# Altium schematic sheet GSM.SchDoc: GSM
size A4; SheetNumber: 9; SheetTotal: 10
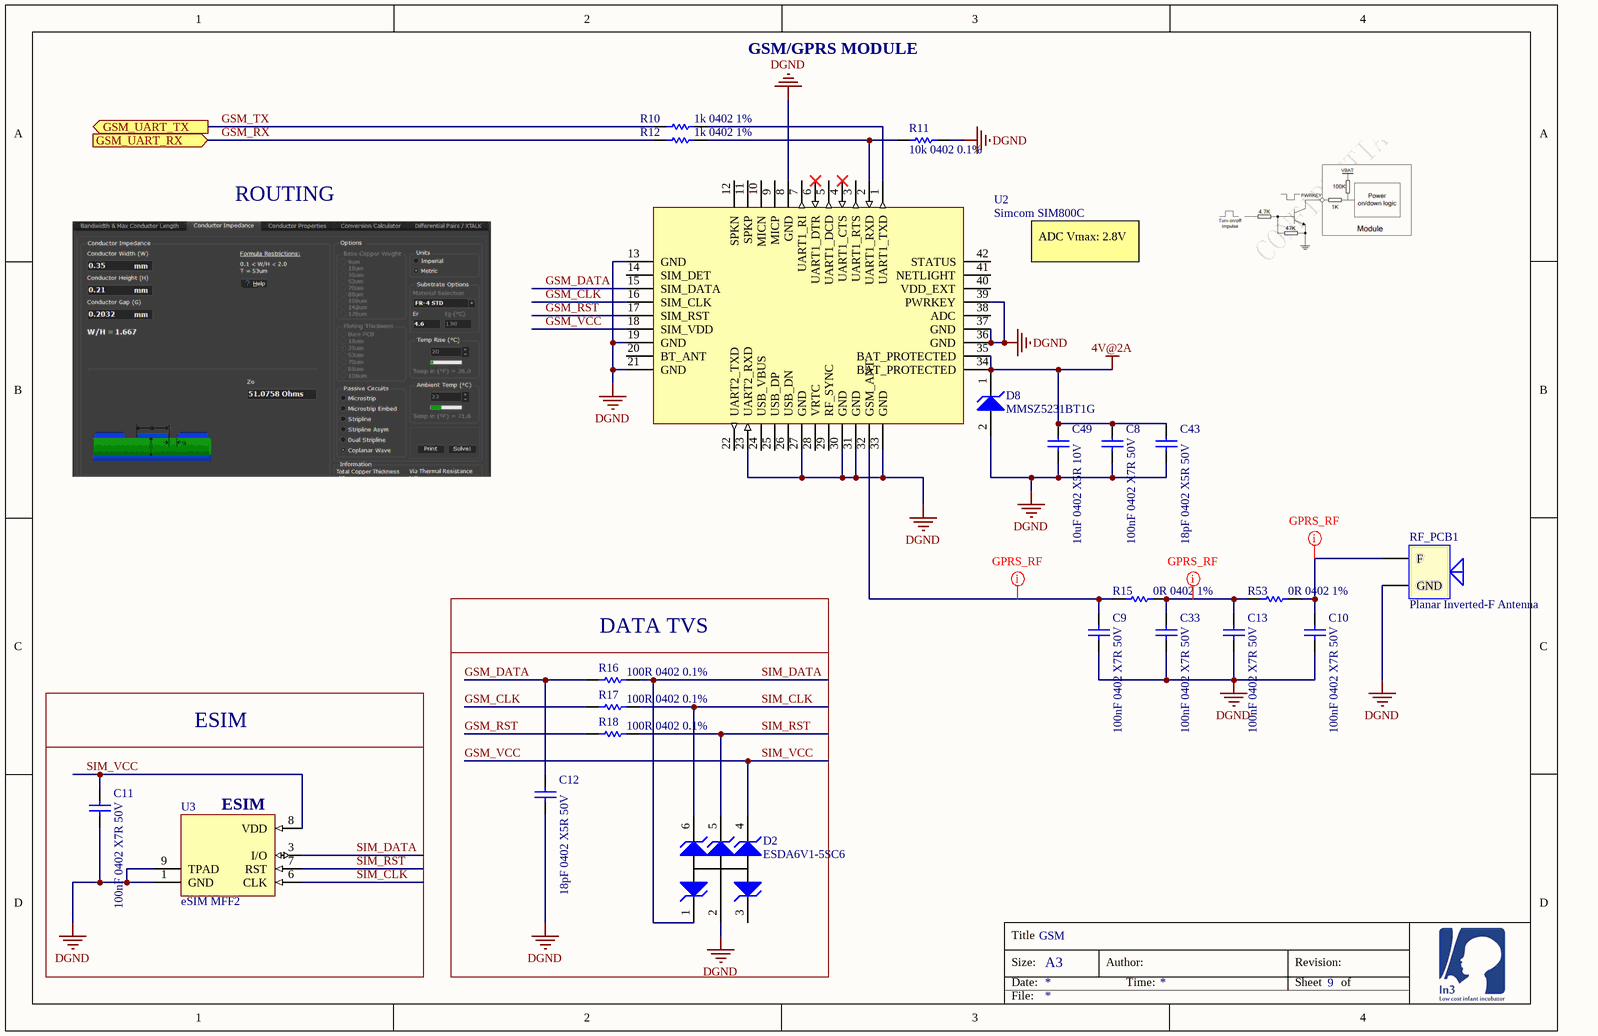
[diagram p0: GSM.SchDoc]

## Parts
C8  100nF 0402 X7R 50V  [CAPC1005X55X25NL5T10]
C9  100nF 0402 X7R 50V  [CAPC1005X55X25NL5T10]
C10  100nF 0402 X7R 50V  [CAPC1005X55X25NL5T10]
C11  100nF 0402 X7R 50V  [CAPC1005X55X25NL5T10]
C12  18pF 0402 X5R 50V  [CAPC1005X55X25NL5T10]
C13  100nF 0402 X7R 50V  [CAPC1005X55X25NL5T10]
C33  100nF 0402 X7R 50V  [CAPC1005X55X25NL5T10]
C43  18pF 0402 X5R 50V  [CAPC1005X55X25NL5T10]
C49  10uF 0402 X5R 10V  [CAPC1005X55X25NL5T10]
D2  ESDA6V1-5SC6  [MF06A_N]
D8  MMSZ5231BT1G  [ONSC-SOD-123-2-425-04_V]
R10  1k 0402 1%  [RESC1005X40X25ML05T10]
R11  10k 0402 0.1%  [RESC1005X40X25ML05T10]
R12  1k 0402 1%  [RESC1005X40X25ML05T10]
R15  0R 0402 1%  [RESC1005X40X25ML05T10]
R16  100R 0402 0.1%  [RESC1005X40X25ML05T10]
R17  100R 0402 0.1%  [RESC1005X40X25ML05T10]
R18  100R 0402 0.1%  [RESC1005X40X25ML05T10]
R53  0R 0402 1%  [RESC1005X40X25ML05T10]
RF_PCB1  Planar Inverted-F Antenna  [PCB-k9titb4465gfk1ijwrnj-1]  (no BOM)
U2  Simcom SIM800C  [SIM800C]
U3  eSIM MFF2  [SON127P600X95_HS-9N]

## Blocks framed on the sheet
DATA TVS: C12 D2 R16-R18
ESIM: C11 U3

## Ports
GSM_UART_RX (in), GSM_UART_TX (out)

## Nets
4V@2A: C8.2 C43.2 C49.2 D8.1(K) U2.34(BAT_PROTECTED) U2.35(BAT_PROTECTED)
DGND: C8.1 C9.1 C10.1 C11.1 C12.1 C13.1 C33.1 C43.1 C49.1 D2.2(K) D8.2(A) R11.1 RF_PCB1.2(GND) U2.8(GND) U2.13(GND) U2.19(GND) U2.21(GND) U2.23(UART2_RXD) U2.27(GND) U2.30(GND) U2.31(GND) U2.33(GND) U2.36(GND) U2.37(GND) U2.39(PWRKEY) U3.1(GND) U3.9(TPAD)
GSM_CLK: R17.2 U2.16(SIM_CLK)
GSM_DATA: C12.2 R16.2 U2.15(SIM_DATA)
GSM_RST: R18.2 U2.17(SIM_RST)
GSM_RX: R12.2 ; port GSM_UART_RX
GSM_TX: R10.2 ; port GSM_UART_TX
GSM_VCC: C11.2 D2.4(A) U2.18(SIM_VDD) U3.8(VDD)  [also labelled SIM_VCC]
SIM_CLK: D2.6(A) R17.1 U3.6(CLK)
SIM_DATA: D2.1(K) R16.1 U3.3(I/O)
SIM_RST: D2.5(A) R18.1 U3.7(RST)
NetC9_2: C9.2 R15.2 U2.32(GSM_ANT)
NetC10_2: C10.2 R53.1 RF_PCB1.1(F)
NetC13_2: C13.2 C33.2 R15.1 R53.2
NetR10_1: R10.1 U2.1(UART1_TXD)
NetR11_2: R11.2 R12.1 U2.2(UART1_RXD)

Not connected (* = marked no-connect by the designer): D2 3(K); U2 3(UART1_RTS) 4(UART1_CTS)* 5(UART1_DCD) 6(UART1_DTR)* 7(UART1_RI) 9(MICP) 10(MICN) 11(SPKP) 12(SPKN) 14(SIM_DET) 20(BT_ANT) 22(UART2_TXD) 24(USB_VBUS) 25(USB_DP) 26(USB_DN) 28(VRTC) 29(RF_SYNC) 38(ADC) 40(VDD_EXT) 41(NETLIGHT) 42(STATUS)

## Layout directives
net class GPRS_RF: NetC9_2, NetC10_2, NetC13_2

## Notes on the sheet
- GSM/GPRS MODULE
- ROUTING
- ADC Vmax: 2.8V
- (near U3) ESIM
- Title
- Size:
- Date:
- A3
- Author:
- Time:
- Revision:
- Sheet
- of
- File:

## Library data of the parts
C8-C13 C33 C43 C49 = CMP-1662-00020-1: ComponentLink2Description: Datasheet; ComponentLink2URL: http://psearch.en.murata.com/capacitor/product/GRM155R60J105KE19%23.pdf; ComponentLink1Description: Manufacturer URL; ComponentLink1URL: http://www.murata.com/
  C8-C11 C13 C33: LCSC_PN: C77020
  C12 C43: LCSC_PN: C33149
  C49: LCSC_PN: C77000
D2 = CMP-924f5b40f9684d88-1: ESDA Series 5 Channel 6.1 V 50 pF SMT Uni Directional Transil Array - SOT-23-6L; Operating Voltage: 6.10 V; Power Rating: 100 W; Breakdown Voltage: 7.20 V; Lead-Free Status: Lead Free; REACH SVHC Compliance: No SVHC; Number of Pins: 6; Case/Package: SOT-23; Size-Width: 1.75 mm; Mounting Style: Surface Mount; Manufacturer Part Number: ESDA6V1-5SC6; Size-Height: 1.45 mm; OctopartID: 924f5b40f9684d88; Size-Length: 3.05 mm; Packaging: Tape & Reel (TR), Cut Tape (CT); Octopart URL: http://octopart.com/esda6v1-5sc6-stmicroelectronics-347713; RoHS: Compliant; Voltage Rating (DC): 6.10 V; Lifecycle Status: Active; TME: ESDA6V1-5SC6; LCSC_PN: C6650
D8 = CMP-1060-00573-1: Zener Voltage Regulator, 500 mW, 2-Pin SOD-123, Pb-Free, Tape and Reel; Manufacturer: On Semiconductor; P Max (W): 0.5; VZ Typ (V): 5.1; PackageVersion: Rev. G, 10/2009; Mounting Technology: Surface Mount; ComponentLink2Description: Datasheet; ComponentLink3URL: http://www.onsemi.com/pub_link/Collateral/425-04.PDF; PackageDescription: 2-Pin SOD, Body 1.6 x 2.69 mm; Packing: Tape and Reel; ComponentLink2URL: http://www.onsemi.com/pub_link/Collateral/MMSZ5221BT1-D.PDF; ComponentLink1URL: http://www.onsemi.com/; PartNumber: MMSZ5231BT1G; PackageReference: SOD-123-2-425-04; RoHS: Pb-Free; ComponentLink1Description: Manufacturer URL; ComponentLink3Description: Package Specification; DatasheetVersion: Rev. 12; LCSC_PN: C2759896
R10-R12 R15-R18 R53 = CMP-2002-07472-1
  R10 R12: LCSC_PN: C106235
  R11: LCSC_PN: C190095
  R15 R53: LCSC_PN: C60485
  R16-R18: LCSC_PN: C106233
RF_PCB1 = CMP-e704afk8c25r4a5ypw1c-12: GSM900 and GSM1800  Frequency Bands PCB antenna; CustomComponentID: e704afk8c25r4a5ypw1c
U2 = CMP-72dbb8ea0133ad1c-5: Module: GSM/Bluetooth; GPRS; 2G; 1800MHz, 900MHz; 85.6kbps; SMD; OctopartID: 72dbb8ea0133ad1c; Manufacturer Part Number: SIM800C; Mounting Style: Surface Mount; Octopart URL: http://octopart.com/sim800c-simcom-54220430; LCSC Part: C69120; LCSC_PN: C69119
U3 = CMP-ce8f06c57f401148-2: Embedded SIM card in MFF2; DNP: DNP; LCSC_PN: C5122390